# Altium schematic sheet CONNECTORS.SchDoc
size A4; SheetNumber: 6; SheetTotal: 7
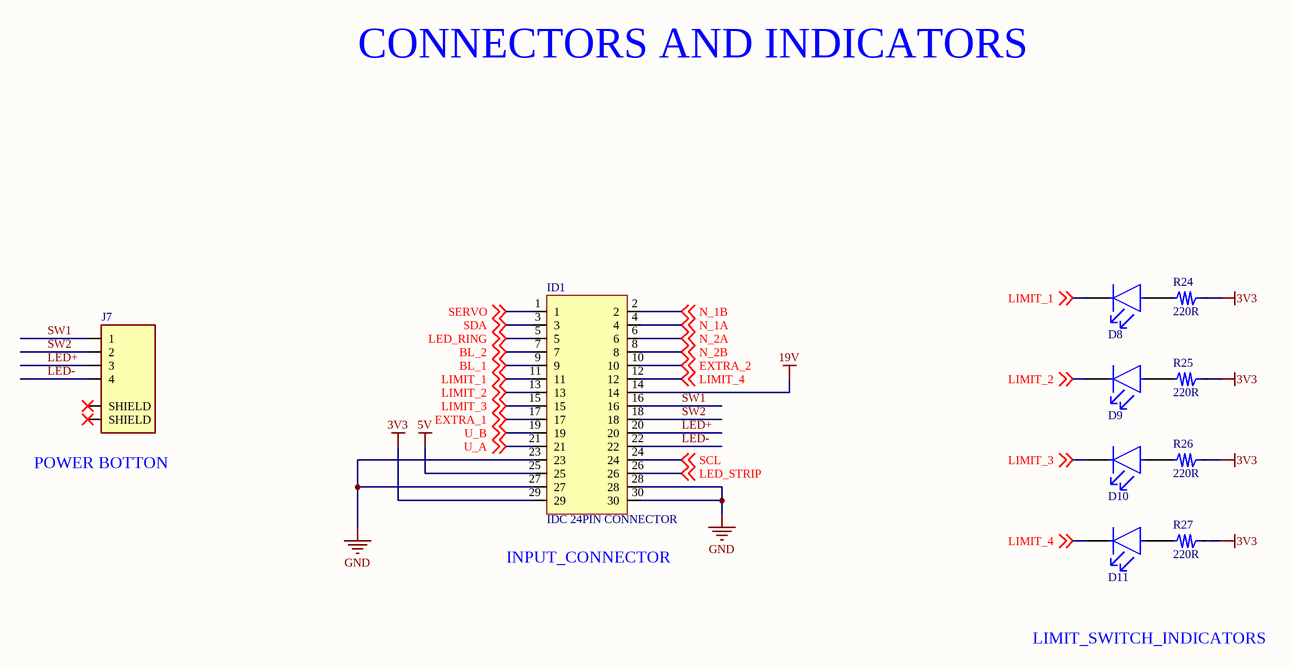
[diagram p0: CONNECTORS.SchDoc]

## Parts
D8  LED  [LED]  (value not drawn)
D9  LED  [LED]  (value not drawn)
D10  LED  [LED]  (value not drawn)
D11  LED  [LED]  (value not drawn)
ID1  IDC 24PIN CONNECTOR  [IDC 30 PIN]
J7  SM04B-SRSS-TB(LF)(SN)  [JST_SM04B-SRSS-TB(LF)(SN)]  (value not drawn)
R24  220R  [RES 0603]
R25  220R  [RES 0603]
R26  220R  [RES 0603]
R27  220R  [RES 0603]

## Nets
3V3: ID1.29 R24.1 R25.1 R26.1 R27.1
5V: ID1.25
19V: ID1.14
GND: ID1.23 ID1.27 ID1.28 ID1.30
BL_1: ID1.9 ; off-sheet BL_1
BL_2: ID1.7 ; off-sheet BL_2
EXTRA_1: ID1.17 ; off-sheet EXTRA_1
EXTRA_2: ID1.10 ; off-sheet EXTRA_2
LED+: ID1.20 J7.3
LED-: ID1.22 J7.4
LED_RING: ID1.5 ; off-sheet LED_RING
LED_STRIP: ID1.26 ; off-sheet LED_STRIP
LIMIT_1: D8.1(C) ID1.11 ; off-sheet LIMIT_1
LIMIT_2: D9.1(C) ID1.13 ; off-sheet LIMIT_2
LIMIT_3: D10.1(C) ID1.15 ; off-sheet LIMIT_3
LIMIT_4: D11.1(C) ID1.12 ; off-sheet LIMIT_4
N_1A: ID1.4 ; off-sheet N_1A
N_1B: ID1.2 ; off-sheet N_1B
N_2A: ID1.6 ; off-sheet N_2A
N_2B: ID1.8 ; off-sheet N_2B
SCL: ID1.24 ; off-sheet SCL
SDA: ID1.3 ; off-sheet SDA
SERVO: ID1.1 ; off-sheet SERVO
SW1: ID1.16 J7.1
SW2: ID1.18 J7.2
U_A: ID1.21 ; off-sheet U_A
U_B: ID1.19 ; off-sheet U_B
NetD8_2: D8.2(A) R24.2
NetD9_2: D9.2(A) R25.2
NetD10_2: D10.2(A) R26.2
NetD11_2: D11.2(A) R27.2

Not connected (* = marked no-connect by the designer): J7 S1(SHIELD)* S2(SHIELD)*

## Notes on the sheet
- CONNECTORS AND INDICATORS
- (near J7) POWER BOTTON
- (near ID1) INPUT_CONNECTOR
- LIMIT_SWITCH_INDICATORS

## Library data of the parts
D8-D11 = LED: Manufacture: XINGLIGHT; Part Number: XL-2012SURC; Footprint size: 0805; ComponentLink1Description: New link; ComponentLink1URL: *; Supplier: LCSC; Supplier Part Number: C965812; Link: https://www.lcsc.com/product-detail/C965812.html?s_z=n_XL-2012SURC
ID1 = IDC 24PIN CONNECTOR: Manufacture: Megastar; Part Number: ZX-IDC2.54-2-15PZZ; Footprint size: Through Hole,P=2.54mm; Supplier: LCSC; Supplier Part Number: C7501248; Link: https://www.lcsc.com/product-detail/C7501248.html?spm=wm.fly.bg.1.xh___wm.sxq.ssx.dcs.1&lcsc_vid=RFYMBlMFQAQLUVJeFVJZXwVeRFYIAgBXEVkPUlxRRVUxVlNRQFRdUlNRR1daVzsOAxUeFF5JWBYZEEoBGA4JCwFIFA4DSA%3D%3D
J7 = SM04B-SRSS-TB(LF)(SN): Connector Header Surface Mount, Right Angle 4 position 0.039 (1.00mm); Manufacture: JST; Part Number: SM04B-SRSS-TB(LF)(SN); Footprint size: SMD,P=1mm,Surface Mount,Right Angle; Supplier: LCSC; Supplier Part Number: C160404; Link: https://www.lcsc.com/product-detail/C160404.html?s_z=n_q_SM04B-SRSS-TB%28LF%29%28SN%29&spm=wm.ssy.bg.0.xh&lcsc_vid=RFYMBlMFQAQLUVJeFVJZXwVeRFYIAgBXEVkPUlxRRVUxVlNRQVlZVVBSQVVXUzsOAxUeFF5JWBYZEEoKFBINSQcJGk4%3D
R24-R27 = Resistor: Manufacture: YAGEO; Part Number: RC0603JR-07220RL; Footprint size: 0603; ComponentLink1Description: New link; ComponentLink1URL: *; Supplier: LCSC; Supplier Part Number: C114683; Link: https://www.lcsc.com/product-detail/C114683.html